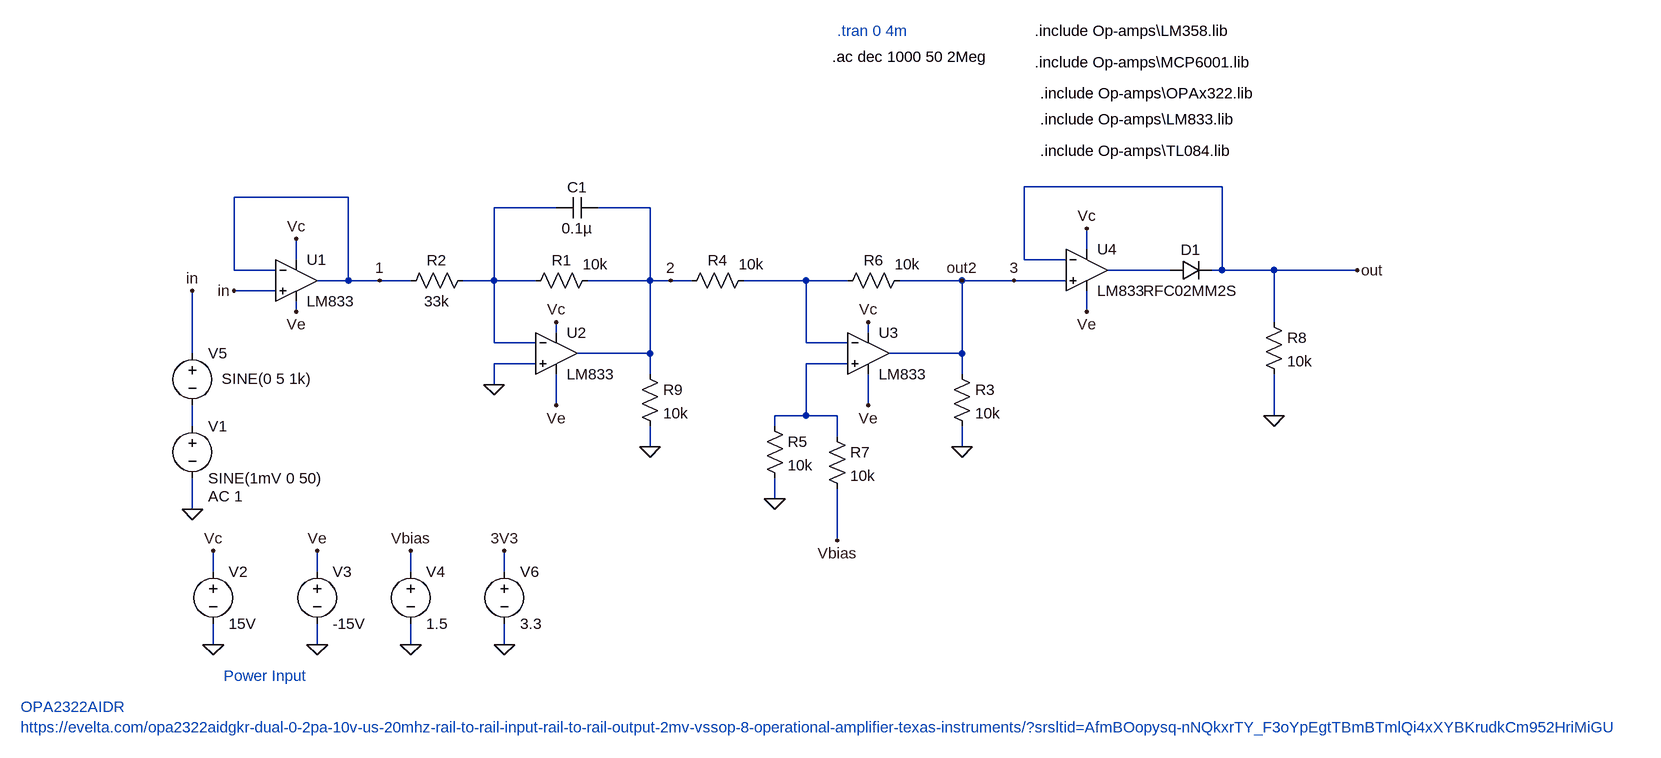
[diagram p0: schematic Simulation File.asc]
Simulation File.asc, the LTspice schematic file:
Version 4.1
SHEET 1 2852 1004
WIRE 992 160 688 160
WIRE -352 176 -528 176
WIRE -32 192 -128 192
WIRE 112 192 32 192
WIRE 784 256 784 224
WIRE -432 272 -432 240
WIRE 688 272 688 160
WIRE 752 272 688 272
WIRE -528 288 -528 176
WIRE -464 288 -528 288
WIRE 912 288 816 288
WIRE 992 288 992 160
WIRE 992 288 976 288
WIRE 1072 288 992 288
WIRE 1200 288 1072 288
WIRE -352 304 -352 176
WIRE -352 304 -400 304
WIRE -304 304 -352 304
WIRE -256 304 -304 304
WIRE -128 304 -128 192
WIRE -128 304 -176 304
WIRE -64 304 -128 304
WIRE 112 304 112 192
WIRE 112 304 16 304
WIRE 144 304 112 304
WIRE 176 304 144 304
WIRE 352 304 256 304
WIRE 416 304 352 304
WIRE 592 304 496 304
WIRE 672 304 592 304
WIRE 752 304 672 304
WIRE -464 320 -528 320
WIRE -432 352 -432 336
WIRE 784 352 784 320
WIRE 1072 368 1072 288
WIRE -32 384 -32 368
WIRE 448 384 448 368
WIRE -128 400 -128 304
WIRE -64 400 -128 400
WIRE 352 400 352 304
WIRE 416 400 352 400
WIRE -592 416 -592 320
WIRE 112 416 112 304
WIRE 112 416 0 416
WIRE 592 416 592 304
WIRE 592 416 480 416
WIRE -64 432 -128 432
WIRE 416 432 352 432
WIRE 112 448 112 416
WIRE 592 448 592 416
WIRE -128 464 -128 432
WIRE -32 496 -32 448
WIRE 448 496 448 448
WIRE 352 512 352 432
WIRE 352 512 304 512
WIRE 400 512 352 512
WIRE 1072 512 1072 448
WIRE -592 528 -592 496
WIRE 304 528 304 512
WIRE 400 544 400 512
WIRE 112 560 112 528
WIRE 592 560 592 528
WIRE 304 640 304 608
WIRE -592 656 -592 608
WIRE 400 704 400 624
WIRE -560 752 -560 720
WIRE -400 752 -400 720
WIRE -256 752 -256 720
WIRE -112 752 -112 720
WIRE -560 864 -560 832
WIRE -400 864 -400 832
WIRE -256 864 -256 832
WIRE -112 864 -112 832
FLAG -592 656 0
FLAG -560 864 0
FLAG -400 864 0
FLAG -560 720 Vc
FLAG -400 720 Ve
FLAG -32 496 Ve
FLAG -32 368 Vc
FLAG -592 320 in
FLAG 304 640 0
FLAG -256 864 0
FLAG -256 720 Vbias
FLAG 400 704 Vbias
FLAG 448 496 Ve
FLAG 448 368 Vc
FLAG -128 464 0
FLAG 592 304 out2
FLAG -432 352 Ve
FLAG -432 240 Vc
FLAG 1072 512 0
FLAG 784 224 Vc
FLAG 784 352 Ve
FLAG -528 320 in
FLAG 592 560 0
FLAG 112 560 0
FLAG -112 864 0
FLAG -112 720 3V3
FLAG 1200 288 out
FLAG -304 304 1
FLAG 144 304 2
FLAG 672 304 3
SYMBOL res 32 288 R90
WINDOW 0 0 56 VBottom 2
WINDOW 3 -25 4 VTop 2
SYMATTR InstName R1
SYMATTR Value 10k
SYMBOL res -160 288 R90
WINDOW 0 0 56 VBottom 2
WINDOW 3 32 56 VTop 2
SYMATTR InstName R2
SYMATTR Value 33k
SYMBOL voltage -592 512 R0
WINDOW 123 24 124 Left 2
WINDOW 39 0 0 Left 0
SYMATTR Value2 AC 1
SYMATTR InstName V1
SYMATTR Value SINE(1mV 0 50)
SYMBOL voltage -560 736 R0
SYMATTR InstName V2
SYMATTR Value 15V
SYMBOL voltage -400 736 R0
SYMATTR InstName V3
SYMATTR Value -15V
SYMBOL voltage -256 736 R0
WINDOW 123 0 0 Left 0
WINDOW 39 0 0 Left 0
SYMATTR InstName V4
SYMATTR Value 1.5
SYMBOL res 512 288 R90
WINDOW 0 0 56 VBottom 2
WINDOW 3 -25 4 VTop 2
SYMATTR InstName R6
SYMATTR Value 10k
SYMBOL res 1056 352 R0
SYMATTR InstName R8
SYMATTR Value 10k
SYMBOL diode 912 304 R270
WINDOW 0 32 32 VTop 2
WINDOW 3 0 32 VBottom 2
SYMATTR InstName D1
SYMATTR Value RFC02MM2S
SYMBOL res 272 288 R90
WINDOW 0 0 56 VBottom 2
WINDOW 3 -25 4 VTop 2
SYMATTR InstName R4
SYMATTR Value 10k
SYMBOL res 288 512 R0
SYMATTR InstName R5
SYMATTR Value 10k
SYMBOL res 384 528 R0
SYMATTR InstName R7
SYMATTR Value 10k
SYMBOL voltage -592 400 R0
WINDOW 3 45 55 Left 2
WINDOW 123 0 0 Left 0
WINDOW 39 0 0 Left 0
SYMATTR Value SINE(0 5 1k)
SYMATTR InstName V5
SYMBOL OpAmps\\opamp2 -432 240 R0
SYMATTR InstName U1
SYMATTR Value LM833
SYMBOL OpAmps\\opamp2 -32 352 R0
SYMATTR InstName U2
SYMATTR Value LM833
SYMBOL OpAmps\\opamp2 448 352 R0
SYMATTR InstName U3
SYMATTR Value LM833
SYMBOL OpAmps\\opamp2 784 224 R0
SYMATTR InstName U4
SYMATTR Value LM833
SYMBOL res 576 432 R0
SYMATTR InstName R3
SYMATTR Value 10k
SYMBOL res 96 432 R0
SYMATTR InstName R9
SYMATTR Value 10k
SYMBOL voltage -112 736 R0
WINDOW 123 0 0 Left 0
WINDOW 39 0 0 Left 0
SYMATTR InstName V6
SYMATTR Value 3.3
SYMBOL cap 32 176 R90
WINDOW 0 0 32 VBottom 2
WINDOW 3 32 32 VTop 2
SYMATTR InstName C1
SYMATTR Value 0.1µ
TEXT 704 -80 Left 2 !.include Op-amps\\LM358.lib
TEXT 400 -80 Left 2 ;.tran 0 4m
TEXT 392 -40 Left 2 !.ac dec 1000 50 2Meg
TEXT -544 912 Left 2 ;Power Input
TEXT 704 -32 Left 2 !.include Op-amps\\MCP6001.lib
TEXT 712 16 Left 2 !.include Op-amps\\OPAx322.lib
TEXT -856 960 Left 2 ;OPA2322AIDR\nhttps://evelta.com/opa2322aidgkr-dual-0-2pa-10v-us-20mhz-rail-to-rail-input-rail-to-rail-output-2mv-vssop-8-operational-amplifier-texas-instruments/?srsltid=AfmBOopysq-nNQkxrTY_F3oYpEgtTBmBTmlQi4xXYBKrudkCm952HriMiGU
TEXT 712 56 Left 2 !.include Op-amps\\LM833.lib
TEXT 712 104 Left 2 !.include Op-amps\\TL084.lib

The netlist it stands for:
* Simulation File.asc
R1 2 N001 10k
R2 N001 1 33k
V1 N005 0 SINE(1mV 0 50) AC 1
V2 Vc 0 15V
V3 Ve 0 -15V
V4 Vbias 0 1.5
R6 3 N003 10k
R8 out 0 10k
D1 N002 out RFC02MM2S
R4 N003 2 10k
R5 N004 0 10k
R7 N004 Vbias 10k
V5 in N005 SINE(0 5 1k)
X§U1 in 1 Vc Ve 1 LM833  ; pins In+ In- V+ V- OUT
X§U2 0 N001 Vc Ve 2 LM833  ; pins In+ In- V+ V- OUT
X§U3 N004 N003 Vc Ve 3 LM833  ; pins In+ In- V+ V- OUT
X§U4 3 out Vc Ve N002 LM833  ; pins In+ In- V+ V- OUT
R3 3 0 10k
R9 2 0 10k
V6 3V3 0 3.3
C1 2 N001 0.1µ
.model D D
.lib standard.dio
.include Op-amps\LM358.lib
* .tran 0 4m
.ac dec 1000 50 2Meg
* Power Input
.include Op-amps\MCP6001.lib
.include Op-amps\OPAx322.lib
* OPA2322AIDR
* https://evelta.com/opa2322aidgkr-dual-0-2pa-10v-us-20mhz-rail-to-rail-input-rail-to-rail-output-2mv-vssop-8-operational-amplifier-texas-instruments/?srsltid=AfmBOopysq-nNQkxrTY_F3oYpEgtTBmBTmlQi4xXYBKrudkCm952HriMiGU
.include Op-amps\LM833.lib
.include Op-amps\TL084.lib
.backanno
.end